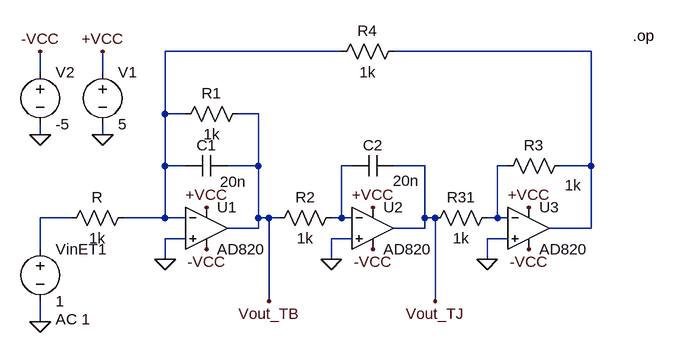
[diagram p0: schematic Etaj2op.asc]
Etaj2op.asc, the LTspice schematic file:
Version 4.1
SHEET 1 880 680
WIRE 176 -128 -96 -128
WIRE 560 -128 256 -128
WIRE -288 -96 -288 -128
WIRE -192 -96 -192 -128
WIRE -96 -32 -96 -128
WIRE -64 -32 -96 -32
WIRE 48 -32 16 -32
WIRE -288 0 -288 -16
WIRE -192 0 -192 -16
WIRE -96 48 -96 -32
WIRE -64 48 -96 48
WIRE 48 48 48 -32
WIRE 48 48 0 48
WIRE 192 48 176 48
WIRE 304 48 256 48
WIRE 432 48 416 48
WIRE 560 48 560 -128
WIRE 560 48 512 48
WIRE -240 128 -288 128
WIRE -96 128 -96 48
WIRE -96 128 -160 128
WIRE -64 128 -96 128
WIRE 48 128 48 48
WIRE 64 128 48 128
WIRE 80 128 64 128
WIRE 176 128 176 48
WIRE 176 128 160 128
WIRE 192 128 176 128
WIRE 304 128 304 48
WIRE 320 128 304 128
WIRE 416 128 416 48
WIRE 416 128 400 128
WIRE 432 128 416 128
WIRE 48 144 48 128
WIRE 48 144 0 144
WIRE 304 144 304 128
WIRE 304 144 256 144
WIRE 560 144 560 48
WIRE 560 144 496 144
WIRE -64 160 -96 160
WIRE 192 160 160 160
WIRE 432 160 400 160
WIRE -288 176 -288 128
WIRE -96 192 -96 160
WIRE 160 192 160 160
WIRE 400 192 400 160
WIRE 64 256 64 128
WIRE 320 256 320 128
WIRE -288 288 -288 256
FLAG -96 192 0
FLAG 160 192 0
FLAG 400 192 0
FLAG -288 0 0
FLAG -192 0 0
FLAG -192 -128 +VCC
FLAG -32 112 +VCC
FLAG 224 112 +VCC
FLAG 464 112 +VCC
FLAG -288 -128 -VCC
FLAG -32 176 -VCC
FLAG 224 176 -VCC
FLAG 464 176 -VCC
FLAG -288 288 0
FLAG 64 256 Vout_TB
FLAG 320 256 Vout_TJ
DATAFLAG 64 224 ""
DATAFLAG 320 240 ""
DATAFLAG -288 128 ""
DATAFLAG -128 128 ""
DATAFLAG 384 -128 ""
SYMBOL OpAmps\\AD820 -32 80 R0
SYMATTR InstName U1
SYMBOL OpAmps\\AD820 224 80 R0
SYMATTR InstName U2
SYMBOL OpAmps\\AD820 464 80 R0
SYMATTR InstName U3
SYMBOL res -144 112 R90
WINDOW 0 0 56 VBottom 2
WINDOW 3 32 56 VTop 2
SYMATTR InstName R
SYMATTR Value 1k
SYMBOL cap 0 32 R90
WINDOW 0 0 32 VBottom 2
WINDOW 3 25 -9 VTop 2
SYMATTR InstName C1
SYMATTR Value 20n
SYMBOL res 32 -48 R90
WINDOW 0 0 56 VBottom 2
WINDOW 3 32 56 VTop 2
SYMATTR InstName R1
SYMATTR Value 1k
SYMBOL res 176 112 R90
WINDOW 0 0 56 VBottom 2
WINDOW 3 32 56 VTop 2
SYMATTR InstName R2
SYMATTR Value 1k
SYMBOL cap 256 32 R90
WINDOW 0 0 32 VBottom 2
WINDOW 3 23 -19 VTop 2
SYMATTR InstName C2
SYMATTR Value 20n
SYMBOL res 416 112 R90
WINDOW 0 0 56 VBottom 2
WINDOW 3 32 56 VTop 2
SYMATTR InstName R31
SYMATTR Value 1k
SYMBOL res 528 32 R90
WINDOW 0 0 56 VBottom 2
WINDOW 3 30 -4 VTop 2
SYMATTR InstName R3
SYMATTR Value 1k
SYMBOL res 272 -144 R90
WINDOW 0 0 56 VBottom 2
WINDOW 3 32 56 VTop 2
SYMATTR InstName R4
SYMATTR Value 1k
SYMBOL voltage -192 -112 R0
SYMATTR InstName V1
SYMATTR Value 5
SYMBOL voltage -288 -112 R0
SYMATTR InstName V2
SYMATTR Value -5
SYMBOL voltage -288 160 R0
WINDOW 123 24 124 Left 2
WINDOW 39 0 0 Left 0
SYMATTR Value2 AC 1
SYMATTR InstName VinET1
SYMATTR Value 1
TEXT 624 -152 Left 2 !.op

The netlist it stands for:
* Etaj2op.asc
X§U1 0 N001 +VCC -VCC Vout_TB AD820  ; pins In+ In- V+ V- OUT
X§U2 0 N003 +VCC -VCC Vout_TJ AD820  ; pins In+ In- V+ V- OUT
X§U3 0 N004 +VCC -VCC N002 AD820  ; pins In+ In- V+ V- OUT
R N001 N005 1k
C1 Vout_TB N001 20n
R1 Vout_TB N001 1k
R2 N003 Vout_TB 1k
C2 Vout_TJ N003 20n
R31 N004 Vout_TJ 1k
R3 N002 N004 1k
R4 N002 N001 1k
V1 +VCC 0 5
V2 -VCC 0 -5
VinET1 N005 0 1 AC 1
.op
.backanno
.end